# EAGLE design I2CBuff (EAGLE 9.6.2)

## Sheet 1 of 2: Board to Board Headers
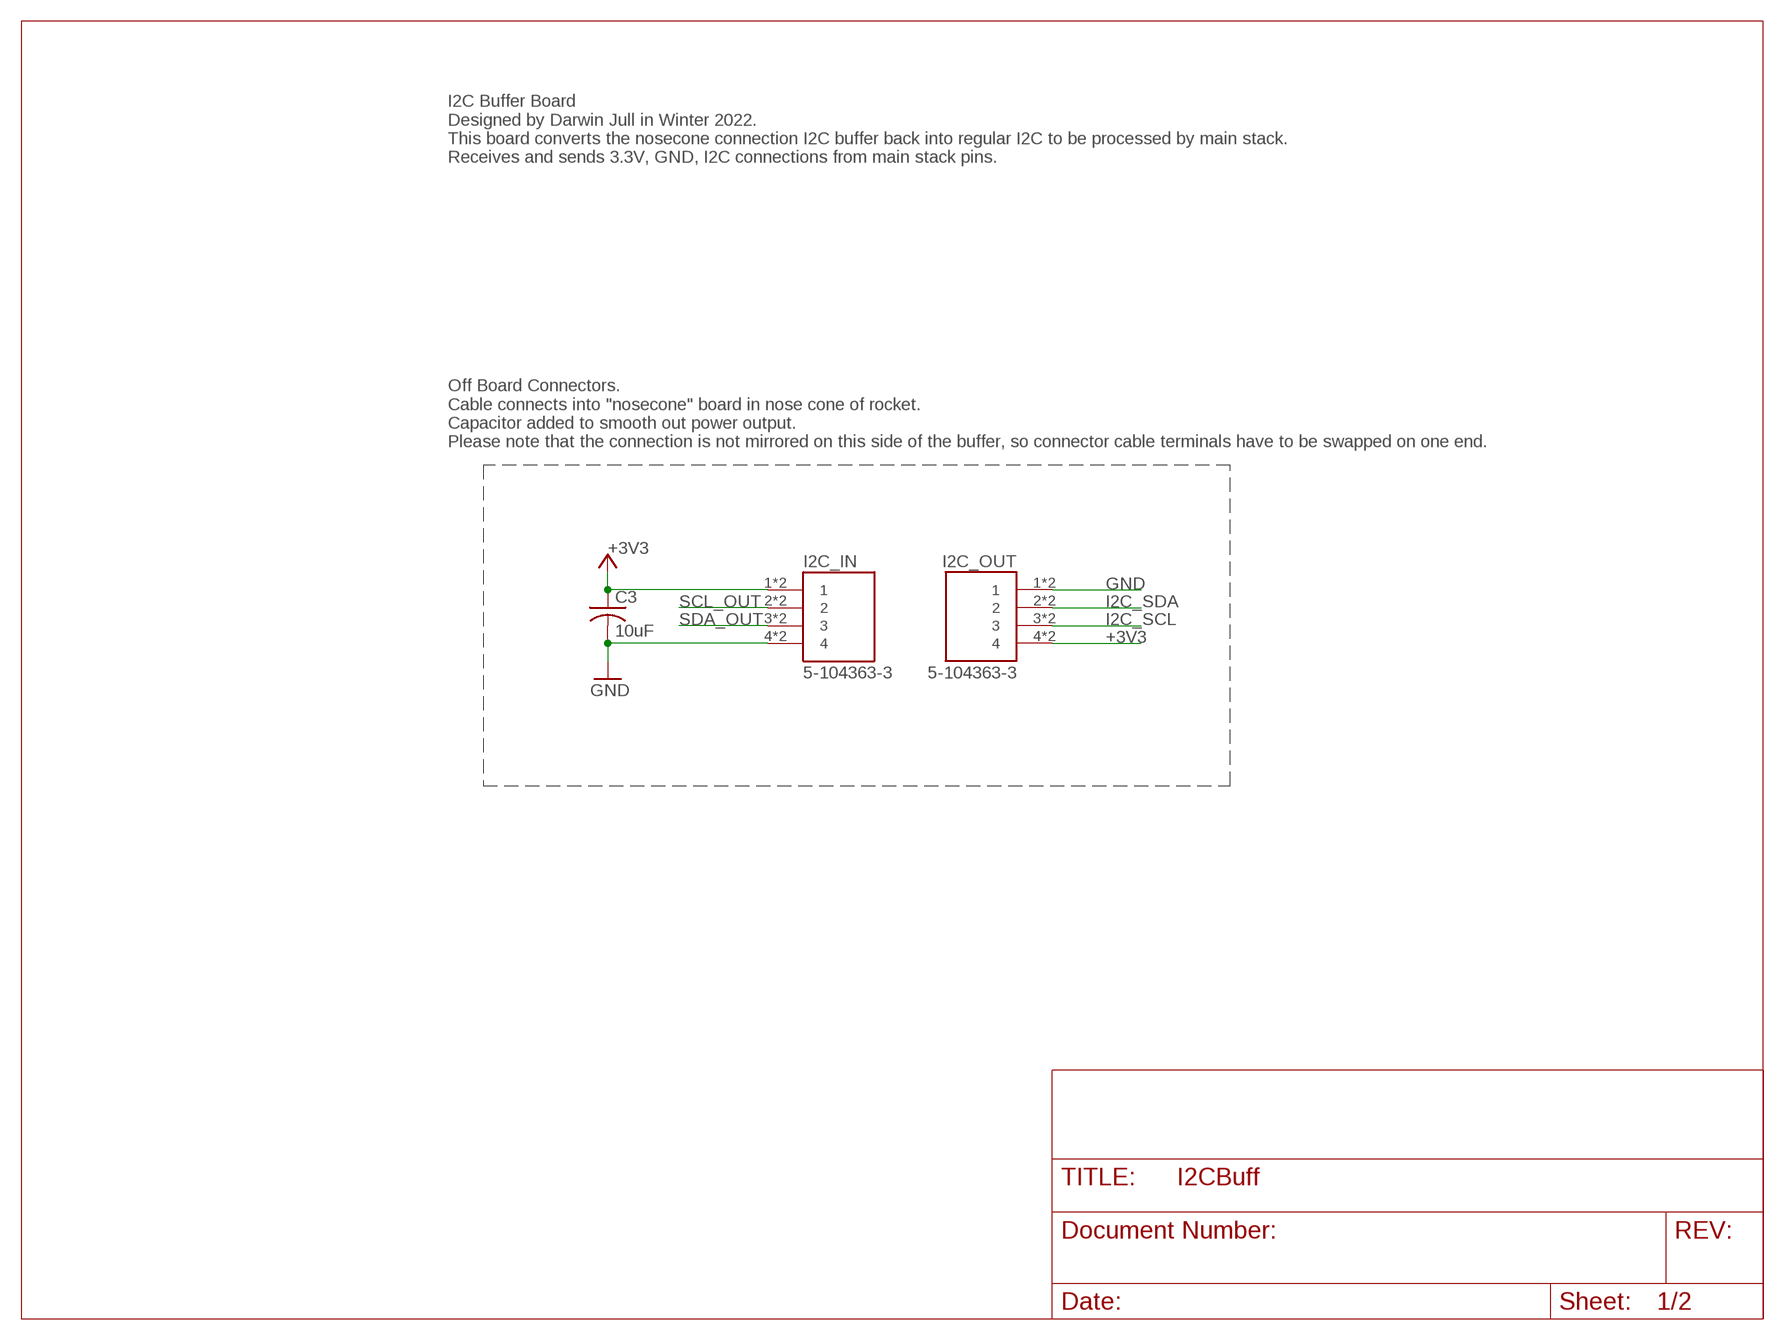
[diagram p0: schematic, sheet 1]

### Parts
C3  10uF  C-USC0805  [C0805]
I2C_IN  5-104363-3  [TE_5-104363-3]
I2C_OUT  5-104363-3  [TE_5-104363-3]

### Nets
+3V3: C3.1 I2C_IN.1 I2C_IN.1_1 I2C_OUT.4 I2C_OUT.4_1 ; also sheet 2
GND: C3.2 I2C_IN.4 I2C_IN.4_1 I2C_OUT.1 I2C_OUT.1_1 ; also sheet 2
I2C_SCL: I2C_OUT.3 I2C_OUT.3_1 ; also sheet 2
I2C_SDA: I2C_OUT.2 I2C_OUT.2_1 ; also sheet 2
SCL_OUT: I2C_IN.2 I2C_IN.2_1 ; also sheet 2
SDA_OUT: I2C_IN.3 I2C_IN.3_1 ; also sheet 2

### Notes on the sheet
- I2C Buffer Board
  Designed by Darwin Jull in Winter 2022.
  This board converts the nosecone connection I2C buffer back into regular I2C to be processed by main stack.
  Receives and sends 3.3V, GND, I2C connections from main stack pins.
- Off Board Connectors.
  Cable connects into "nosecone" board in nose cone of rocket.
  Capacitor added to smooth out power output.
  Please note that the connection is not mirrored on this side of the buffer, so connector cable terminals have to be swapped on one end.

## Sheet 2 of 2: CAN
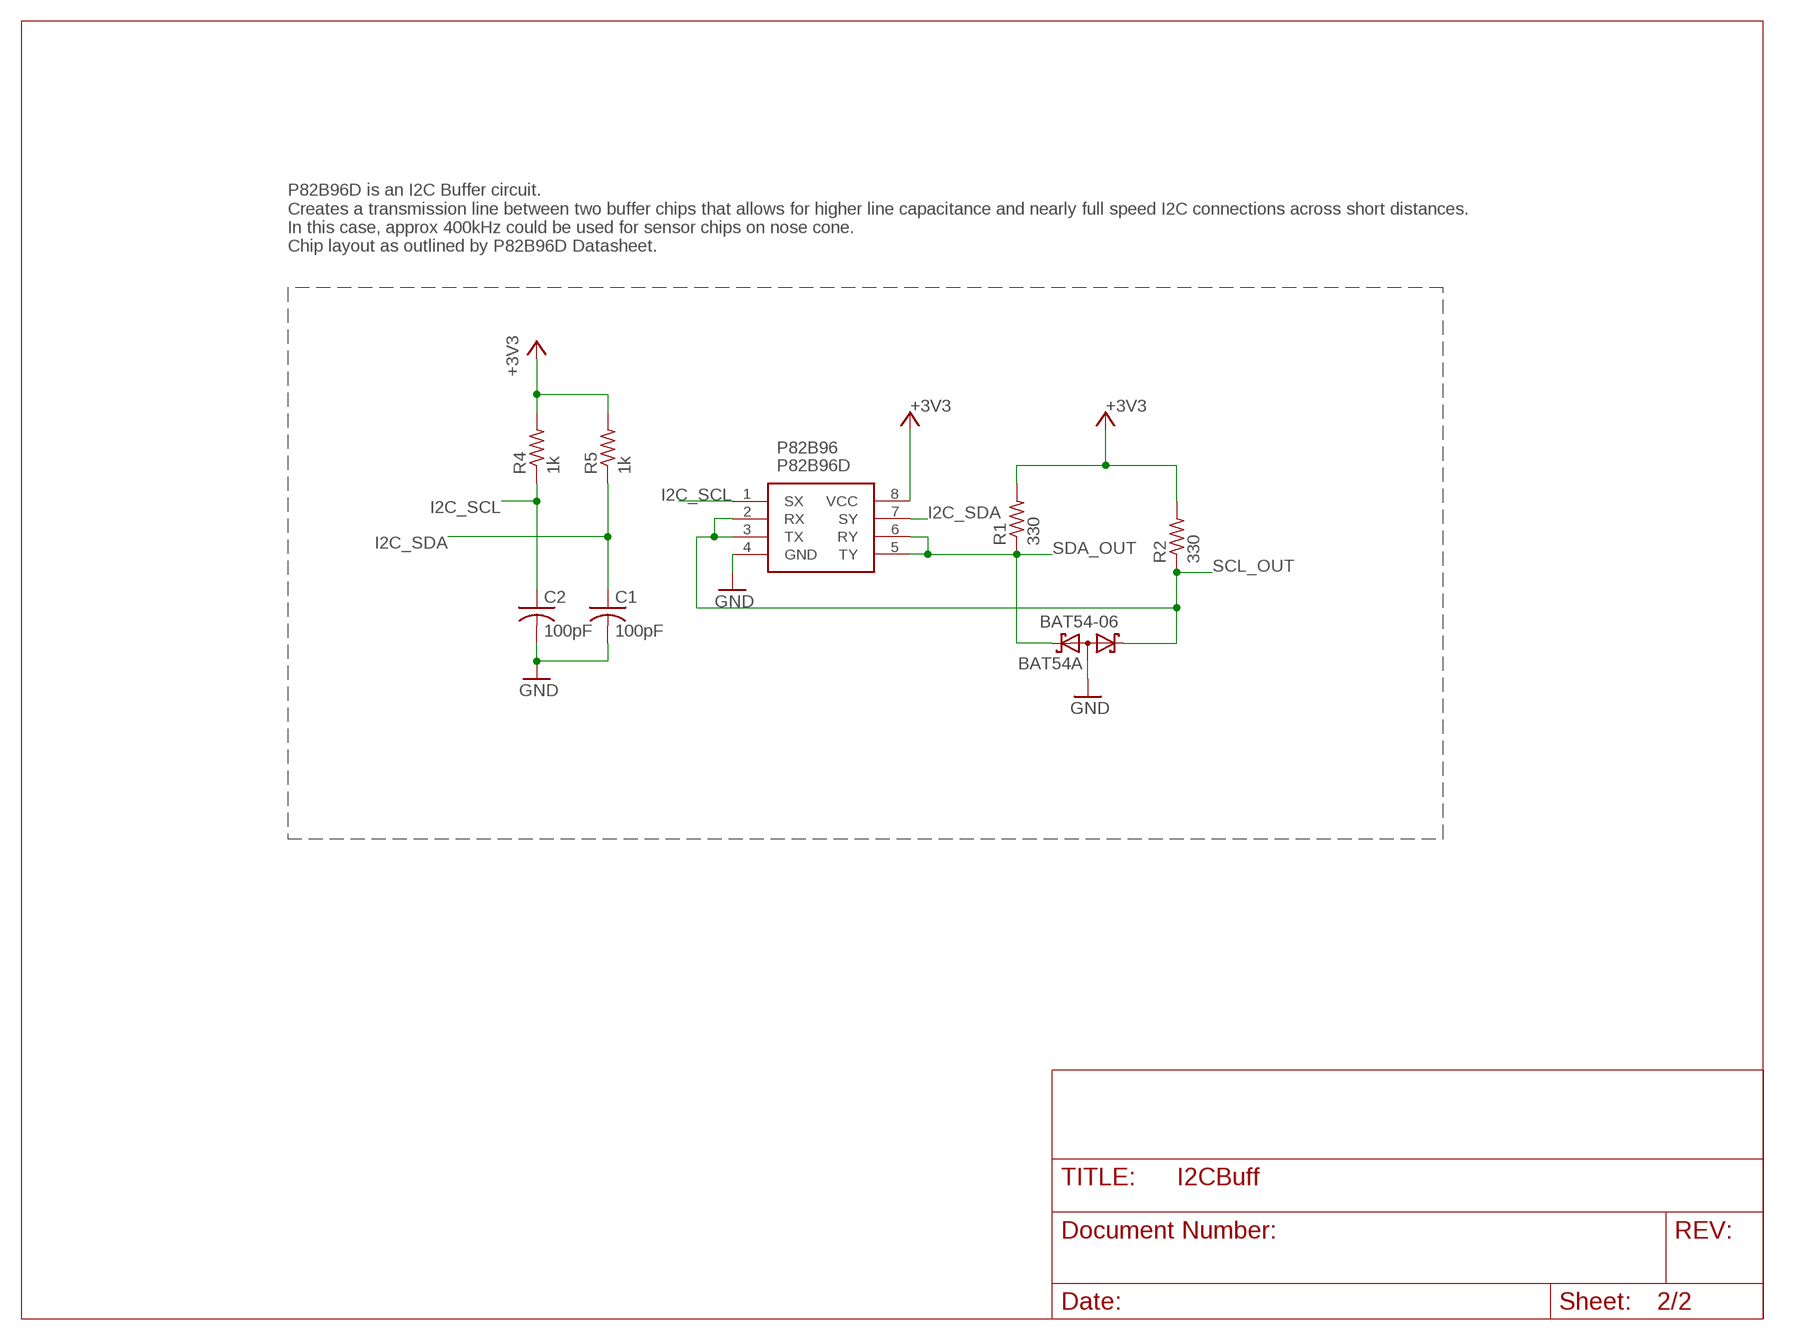
[diagram p1: schematic, sheet 2]

### Parts
C1  100pF  C-USC0805  [C0805]
C2  100pF  C-USC0805  [C0805]
D1  BAT54-06  [SOT23]
P82B96  P82B96D  [SOIC127P600X175-8N]
R1  330  R-US_R0805  [R0805]
R2  330  R-US_R0805  [R0805]
R4  1k  R-US_R0805  [R0805]
R5  1k  R-US_R0805  [R0805]

### Nets
+3V3: P82B96.8(VCC) R1.2 R2.2 R4.2 R5.2 ; also sheet 1
GND: C1.2 C2.2 D1.3 P82B96.4(GND) ; also sheet 1
I2C_SCL: C2.1 P82B96.1(SX) R4.1 ; also sheet 1
I2C_SDA: C1.1 P82B96.7(SY) R5.1 ; also sheet 1
SCL_OUT: D1.1 P82B96.2(RX) P82B96.3(TX) R2.1 ; also sheet 1
SDA_OUT: D1.2 P82B96.5(TY) P82B96.6(RY) R1.1 ; also sheet 1

### Notes on the sheet
- P82B96D is an I2C Buffer circuit. 
  Creates a transmission line between two buffer chips that allows for higher line capacitance and nearly full speed I2C connections across short distances.
  In this case, approx 400kHz could be used for sensor chips on nose cone.
  Chip layout as outlined by P82B96D Datasheet.

## Library data of the parts
C1-C3 = rcl:C-US: CAPACITOR, American symbol; SPICEPREFIX: C
D1 = DJCUINSPACEV1:BAT54-06
I2C_IN I2C_OUT = 5-104363-3:5-104363-3: 4 Positions Header Connector 0.100" (2.54mm) Through Hole Gold; DESCRIPTION: Conn Shrouded Header (4 Sides) HDR 4 POS 2.54mm Solder ST Thru-Hole Box/Tube; DIGI-KEY_PART_NUMBER: A32565-ND; MF: TE Connectivity; MP: 51043633; PACKAGE: None
P82B96 = P82B96D:P82B96D: Texas Instruments P82B96D, Dual, Bus Buffer, 2 15 V, 8-Pin SOIC Source: Datasheet <http://www.ti.com/lit/gpn/P82B96>; ARROW_PART_NUMBER: P82B96D; ARROW_PRICE-STOCK: https://www.arrow.com/en/products/p82b96d/texas-instruments; DESCRIPTION: Texas Instruments P82B96D, Dual, Bus Buffer, 2 15 V, 8-Pin SOIC; HEIGHT: 1.75mm; MANUFACTURER_NAME: Texas Instruments; MANUFACTURER_PART_NUMBER: P82B96D; MOUSER_PART_NUMBER: 595-P82B96D; MOUSER_PRICE-STOCK: https://www.mouser.co.uk/ProductDetail/Texas-Instruments/P82B96D?qs=aEuGZpxfbxXCtC%252BvOJGocw%3D%3D
R1 R2 R4 R5 = rcl:R-US_: RESISTOR, American symbol; SPICEPREFIX: R

## Board
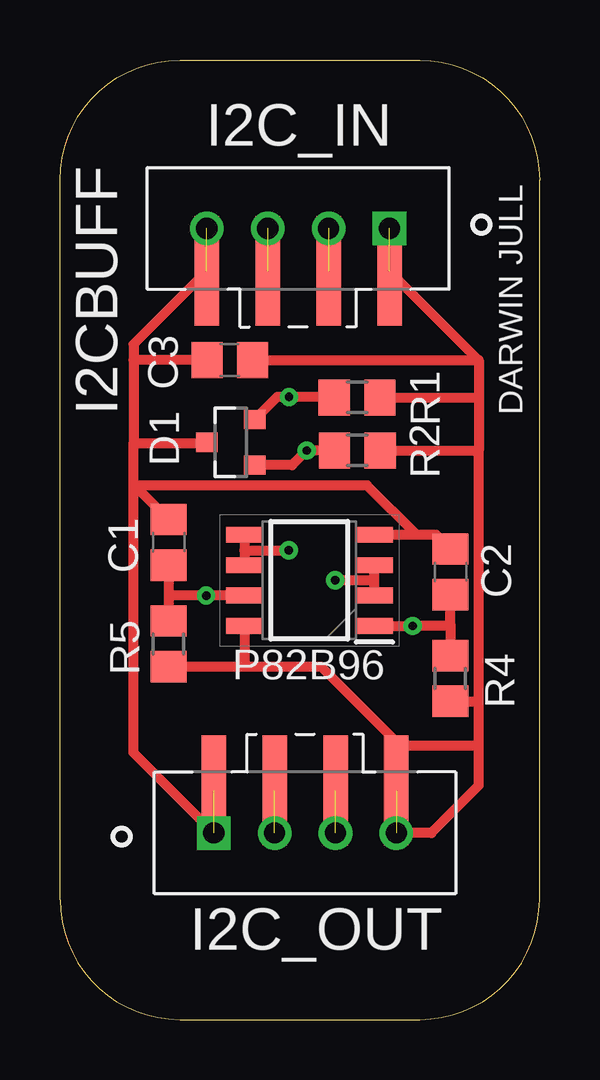
[diagram p2: board, top side]
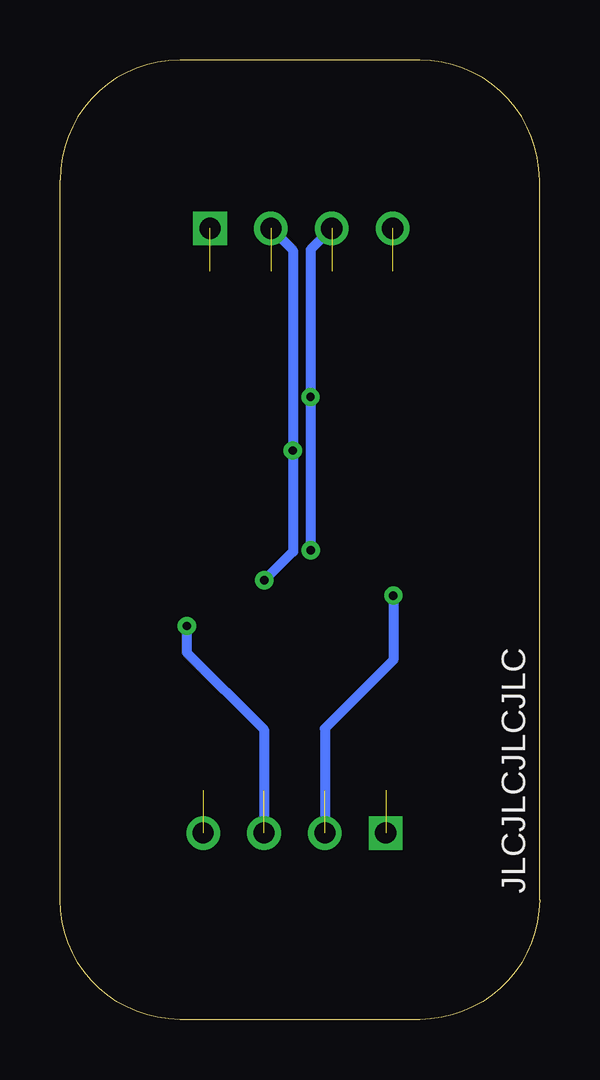
[diagram p3: board, bottom side, seen from below]

Size 20 x 40 mm. Coordinates in mm from the lower left corner, seen from the top.
Outline: 0,35 arc-90 5,40 15,40 arc-90 20,35 20,5 arc-90 15,0 5,0 arc-90 0,5 0,35
Copper layers (1*16): Top 0.035mm / dielectric 1.5mm / Bottom 0.035mm
Design rules "default": minimum track width 6mil, minimum drill 0.35mm, track to track 6mil, track to pad 6mil, pad to pad 6mil, via to via 6mil, smd to smd 6mil, copper to edge 40mil, drill to drill 6mil, minimum pad ring 10mil, minimum via ring 8mil, stop-mask expansion 4mil, vias tented up to drill 0mil, thermal gap 10mil

### Footprints (pad centres in the part's own frame; a part is rotated, then mirrored left to right if it is on the bottom)
C0805 = smd 1.3 x 1.5: 1 -0.95,0; 2 0.95,0
SOT23 = smd 0.8 x 0.9: 1 -0.95,-1; 2 0.95,-1; 3 0,1
TE_5-104363-3 = drill 0.89 pad 1.02 square: 1 -3.81,0 | smd 1.02 x 4.57: 1_1 -3.81,1.775; 2_1 -1.27,1.775; 3_1 1.27,1.775; 4_1 3.81,1.775 | drill 0.89 pad 1.02: 2 -1.27,0; 3 1.27,0; 4 3.81,0
SOIC127P600X175-8N = smd 1.528 x 0.65: 1 -2.711,1.905; 2 -2.711,0.635; 3 -2.711,-0.635; 4 -2.711,-1.905; 5 2.711,-1.905; 6 2.711,-0.635; 7 2.711,0.635; 8 2.711,1.905
R0805 = smd 1.3 x 1.5: 1 -0.95,0; 2 0.95,0

### Placement (x,y rotation side)
C1  4.54,19.89 90 top
C2  16.29,18.66 90 top
C3  7.08,27.49 180 top
D1  7.12,24.06 90 top
I2C_IN  9.93,32.98 180 top
I2C_OUT  10.22,7.78 0 top
P82B96  10.4,18.31 180 top
R1  12.39,25.93 0 top
R2  12.4,23.72 0 top
R4  16.28,14.22 270 top
R5  4.53,15.66 270 top

### Tracks (layer width: path | path; a pad name or v marks a point on that pad's centre or on a via)
+3V3  (2 unrouted)
  Top 0.406: I2C_IN.1_1 17.45,27.49 | I2C_OUT.4 15.49,7.78 17.45,9.74 17.45,11.44 | 17.46,25.93 17.46,27.49 17.45,27.49 | 17.46,25.93 17.46,23.72 17.45,23.72 | 17.45,23.72 17.45,13.27 | 17.45,13.27 17.45,11.44 | R4.2 17.45,13.27 | R5.2 7.7,14.71 | 7.7,14.71 10.89,14.71 14.18,11.42 17.43,11.42 17.45,11.44 | P82B96.8 7.69,14.72 7.7,14.71 | C3.1 17.45,27.49 | R1.2 17.46,25.93 | R2.2 17.45,23.72
GND  (2 unrouted)
  Top 0.406: P82B96.4 14.86,20.21 | 14.86,20.21 15.68,20.21 C2.2 | I2C_IN.4_1 3.07,28.16 3.07,27.5 | 3.07,27.5 3.07,24.03 | 3.07,24.03 3.06,24.03 3.06,22.32 | 3.07,24.03 6.09,24.03 D1.3 | C3.2 3.08,27.49 3.07,27.5 | 3.06,22.32 C1.2 | 3.06,22.32 3.06,22.27 | 3.06,22.27 3.06,11.13 I2C_OUT.1 | 14.86,20.21 12.8,22.27 3.06,22.27
I2C_SCL  (via drill 0.35)  (1 unrouted)
  Top 0.406: P82B96.1 v14.71,16.41 16.25,16.41 16.26,16.4 | 16.26,16.4 16.29,16.43 C2.1 | 16.26,16.4 16.28,16.38 R4.1
  Bottom 0.406: v14.71,16.41 14.71,15.31 11.49,12.09 I2C_OUT.3
I2C_SDA  (via drill 0.35)  (1 unrouted)
  Top 0.406: C1.1 4.54,17.67 | 4.54,17.67 R5.1 | P82B96.7 v6.1,17.68 4.54,17.68 4.54,17.67
  Bottom 0.406: v6.1,17.68 6.1,14.98 8.95,12.13 I2C_OUT.2
SCL_OUT  (via drill 0.35)  (1 unrouted)
  Top 0.406: P82B96.2 13.11,18.28 | 13.11,18.28 P82B96.3 | 13.11,18.28 13.08,18.31 v11.48,18.31 | R2.1 v10.29,23.72 9.68,23.11 D1.1
  Bottom 0.406: I2C_IN.2 10.29,32.07 v10.29,23.72 v10.28,23.71 10.28,19.51 v11.48,18.31
SDA_OUT  (via drill 0.35)  (1 unrouted)
  Top 0.406: P82B96.5 7.69,19.56 | 7.69,19.56 P82B96.6 | 7.69,19.56 v9.54,19.56 | R1.1 11.42,25.95 v9.55,25.95 9.06,25.95 D1.2
  Bottom 0.406: I2C_IN.3 9.55,32.09 v9.55,25.95 v9.55,19.57 v9.54,19.56

### Text on the board
tPlace: I2CBUFF | DARWIN JULL
bPlace: JLCJLCJLCJLC